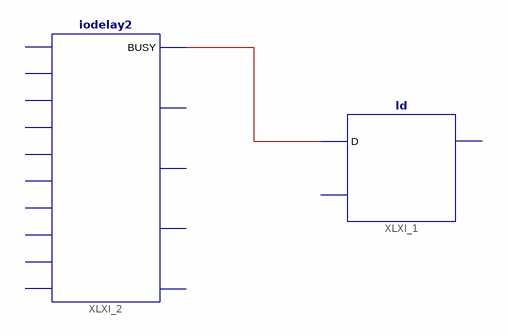
[diagram p0: schematic sheet 1]
// Xilinx ISE schematic kkkk.sch (spartan6) as structural Verilog: 2 symbols, 0 ports
module kkkk (
);

  wire XLXN_1;

  ld XLXI_1 (.D(XLXN_1));  // open: G, Q
  iodelay2 XLXI_2 (.BUSY(XLXN_1));  // open: CAL, CE, CLK, IDATAIN, INC, IOCLK0, IOCLK1, ODATAIN, RST, T, DATAOUT, DATAOUT2, DOUT, TOUT
endmodule
